# EAGLE schematic reva (EAGLE 9.6.2)
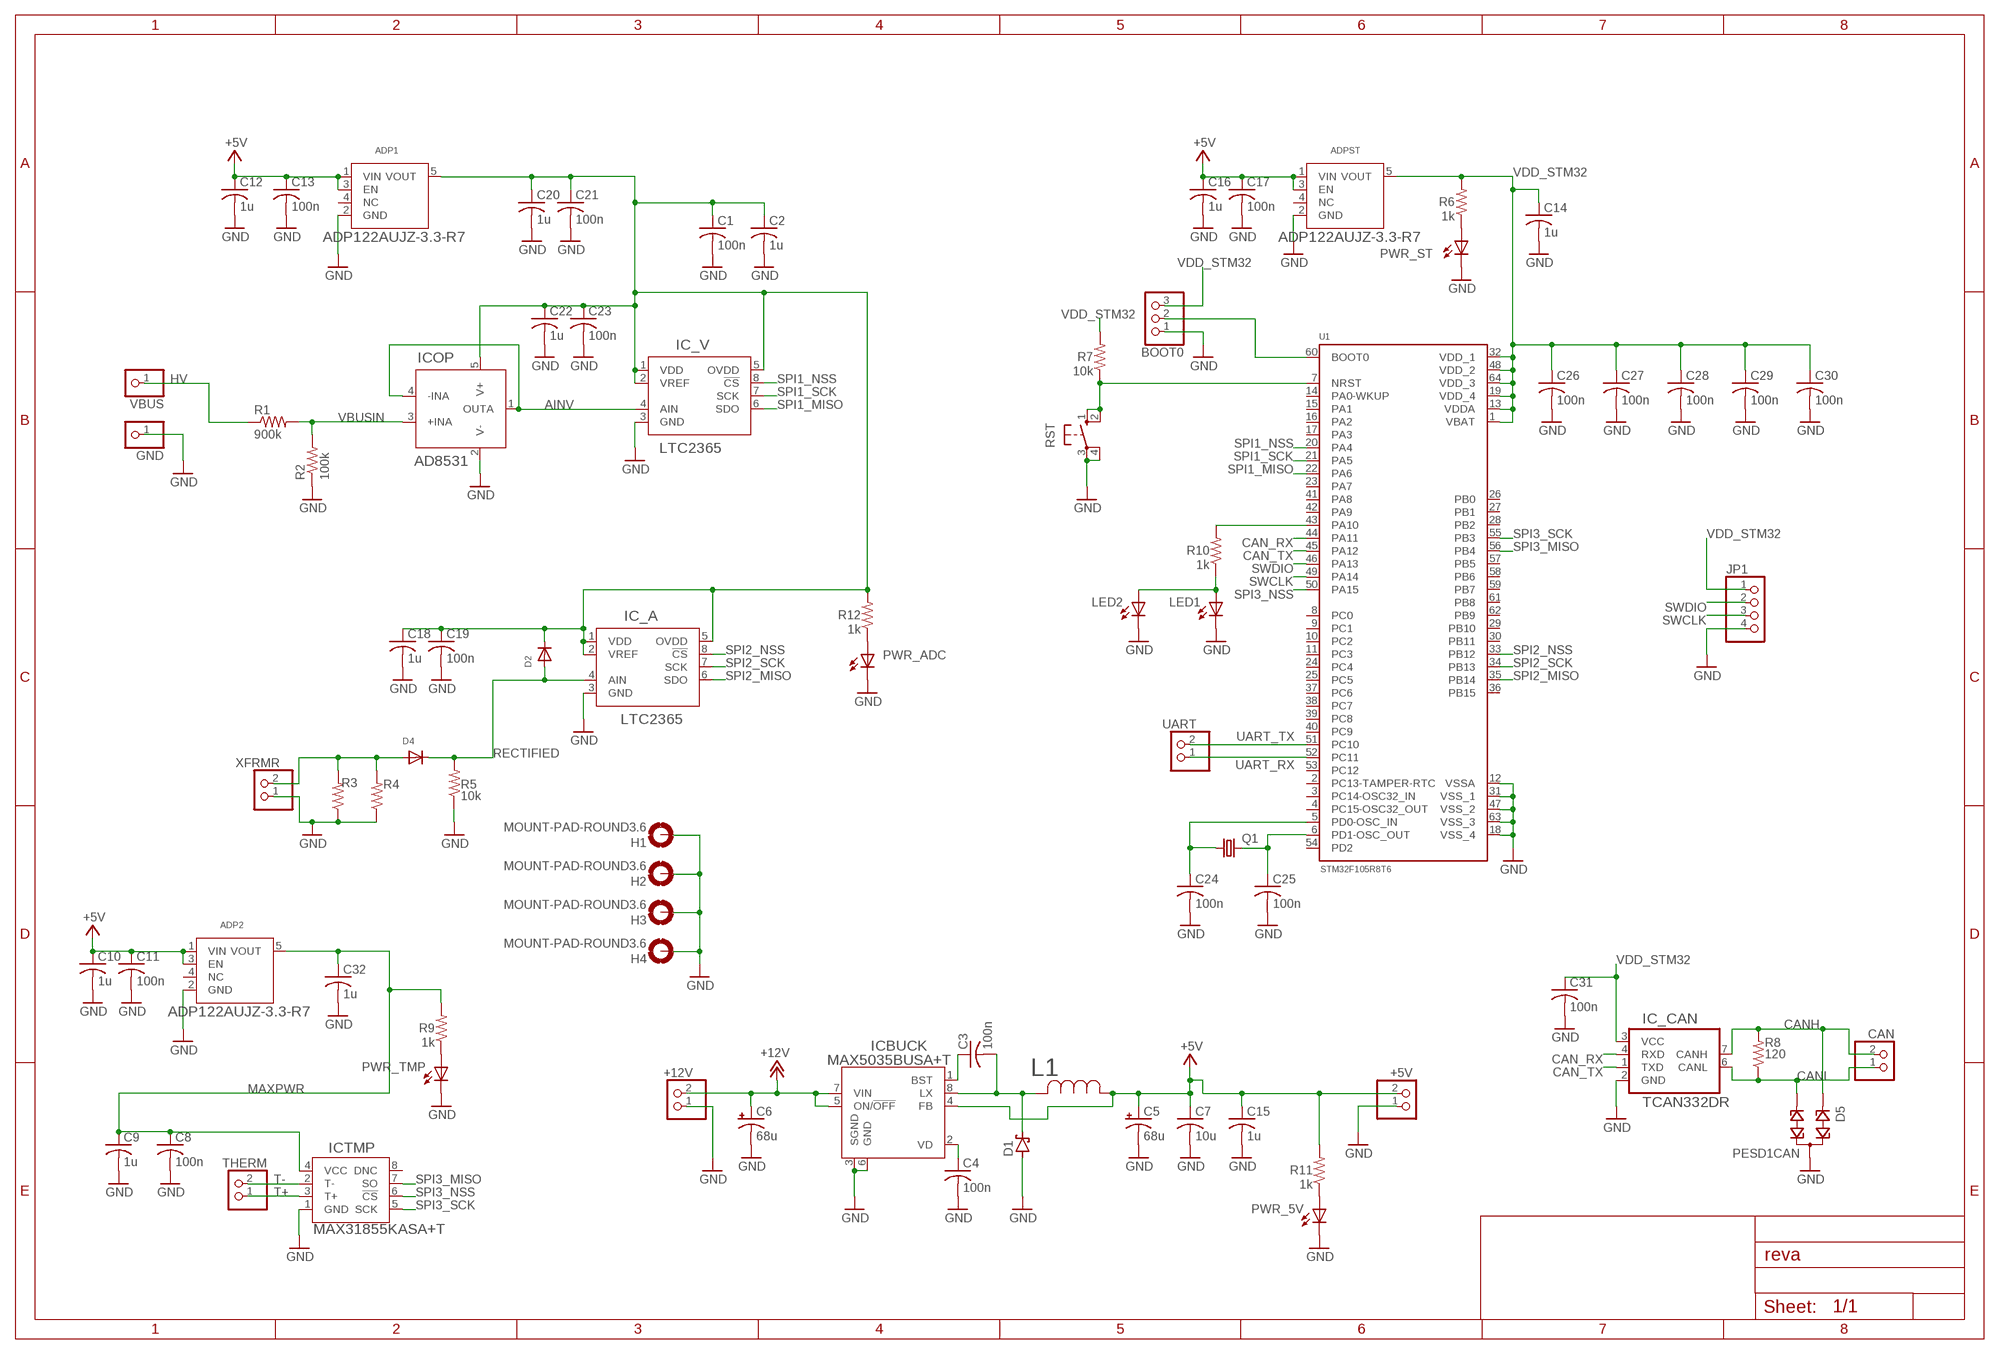
[diagram p0: schematic, sheet 1]

## Parts
+5V  PINHD-1X2  [1X02]
+12V  PINHD-1X2  [1X02]
ADP1  ADP122AUJZ-3.3-R7  [SOT95P280X100-5N]
ADP2  ADP122AUJZ-3.3-R7  [SOT95P280X100-5N]
ADPST  ADP122AUJZ-3.3-R7  [SOT95P280X100-5N]
BOOT0  PINHD-1X3  [1X03]
C1  100n  C-USC0603  [C0603]
C2  1u  C-USC0603  [C0603]
C3  100n  C-USC0603  [C0603]
C4  100n  C-USC0603  [C0603]
C5  68u  CPOL-USE5-8.5  [E5-8,5]
C6  68u  CPOL-USE5-8.5  [E5-8,5]
C7  10u  C-USC0805  [C0805]
C8  100n  C-USC0603  [C0603]
C9  1u  C-USC0603  [C0603]
C10  1u  C-USC0603  [C0603]
C11  100n  C-USC0603  [C0603]
C12  1u  C-USC0603  [C0603]
C13  100n  C-USC0603  [C0603]
C14  1u  C-USC0603  [C0603]
C15  1u  C-USC0603  [C0603]
C16  1u  C-USC0603  [C0603]
C17  100n  C-USC0603  [C0603]
C18  1u  C-USC0603  [C0603]
C19  100n  C-USC0603  [C0603]
C20  1u  C-USC0603  [C0603]
C21  100n  C-USC0603  [C0603]
C22  1u  C-USC0603  [C0603]
C23  100n  C-USC0603  [C0603]
C24  100n  C-USC0603  [C0603]
C25  100n  C-USC0603  [C0603]
C26  100n  C-USC0603  [C0603]
C27  100n  C-USC0603  [C0603]
C28  100n  C-USC0603  [C0603]
C29  100n  C-USC0603  [C0603]
C30  100n  C-USC0603  [C0603]
C31  100n  C-USC0603  [C0603]
C32  1u  C-USC0603  [C0603]
CAN  PINHD-1X2  [1X02]
D1  SCHOTTKY-DIODESMD  [SMB]
D2  DIODESOD-523  [SOD-523]
D4  DIODESOD-523  [SOD-523]
D5  PESD1CAN  [SOT23]
GND  PINHD-1X1CB  [1X01-CLEANBIG]
H1  MOUNT-PAD-ROUND3.6  [3,6-PAD]
H2  MOUNT-PAD-ROUND3.6  [3,6-PAD]
H3  MOUNT-PAD-ROUND3.6  [3,6-PAD]
H4  MOUNT-PAD-ROUND3.6  [3,6-PAD]
IC_A  LTC2365  LTC2365ITS8TRMPBF  [TSOT-23_TS8_LIT]
IC_CAN  TCAN332DR  [SOIC127P599X175-8N]
IC_V  LTC2365  LTC2365ITS8TRMPBF  [TSOT-23_TS8_LIT]
ICBUCK  MAX5035BUSA+T  [21-0041B_8_MXM]
ICOP  AD8531  AD8531ARTZ-REEL7  [RJ_5_ADI]
ICTMP  MAX31855KASA+T  [21-0041B_8_MXM]
JP1  PINHD-1X4  [1X04]
L1  IHLP4040DZER101M11  [IND_IHLP-4040DZ_VIS]
LED1  LED5MM  [LED5MM]
LED2  LEDCHIP-LED0805  [CHIP-LED0805]
PWR_5V  LEDCHIP-LED0805  [CHIP-LED0805]
PWR_ADC  LEDCHIP-LED0805  [CHIP-LED0805]
PWR_ST  LEDCHIP-LED0805  [CHIP-LED0805]
PWR_TMP  LEDCHIP-LED0805  [CHIP-LED0805]
Q1  CRYSTALHC49S  [HC49/S]
R1  900k  R-US_R0805  [R0805]
R2  100k  R-US_R0805  [R0805]
R3  R-US_R0805  [R0805]
R4  R-US_0204/7  [0204/7]
R5  10k  R-US_R0805  [R0805]
R6  1k  R-US_R0805  [R0805]
R7  10k  R-US_R0805  [R0805]
R8  120  R-US_R0805  [R0805]
R9  1k  R-US_R0805  [R0805]
R10  1k  R-US_R0805  [R0805]
R11  1k  R-US_R0805  [R0805]
R12  1k  R-US_R0805  [R0805]
RST  10-XX  [B3F-10XX]
THERM  PINHD-1X2  [1X02]
U1  STM32F105R8T6  [QFP50P1200X1200X160-64N]
UART  PINHD-1X2  [1X02]
VBUS  PINHD-1X1CB  [1X01-CLEANBIG]
XFRMR  PINHD-1X2  [1X02]

## Nets
+5V: +5V.2 ADP1.1(VIN) ADP1.3(EN) ADP2.1(VIN) ADP2.3(EN) ADPST.1(VIN) ADPST.3(EN) C5.+ C7.1 C10.1 C11.1 C12.1 C13.1 C15.1 C16.1 C17.1 ICBUCK.4(FB) L1.1 R11.2
+12V: +12V.2 C6.+ ICBUCK.5(ON/!OFF) ICBUCK.7(VIN)
AINV: IC_V.4(AIN) ICOP.1(OUTA) ICOP.4(-INA)
CAN_RX: IC_CAN.4(RXD) U1.44(PA11)
CAN_TX: IC_CAN.1(TXD) U1.45(PA12)
CANH: CAN.2 D5.1 IC_CAN.7(CANH) R8.2
CANL: CAN.1 D5.2 IC_CAN.6(CANL) R8.1
CUR+: D4.A R3.2 R4.2 XFRMR.2
GND: +5V.1 +12V.1 ADP1.2(GND) ADP2.2(GND) ADPST.2(GND) BOOT0.1 C1.2 C2.2 C4.2 C5.- C6.- C7.2 C8.2 C9.2 C10.2 C11.2 C12.2 C13.2 C14.2 C15.2 C16.2 C17.2 C18.2 C19.2 C20.2 C21.2 C22.2 C23.2 C24.2 C25.2 C26.2 C27.2 C28.2 C29.2 C30.2 C31.2 C32.2 D1.A D5.3 GND.1 H1.B3,6(MOUNT) H2.B3,6(MOUNT) H3.B3,6(MOUNT) H4.B3,6(MOUNT) IC_A.3(GND) IC_CAN.2(GND) IC_V.3(GND) ICBUCK.3(SGND) ICBUCK.6(GND) ICOP.2(V-) ICTMP.1(GND) JP1.4 LED1.K(C) LED2.C PWR_5V.C PWR_ADC.C PWR_ST.C PWR_TMP.C R2.1 R3.1 R4.1 R5.1 RST.3(P) RST.4(P1) U1.12(VSSA) U1.18(VSS_4) U1.31(VSS_1) U1.47(VSS_2) U1.63(VSS_3) XFRMR.1
HV: R1.1 VBUS.1
MAXPWR: ADP2.5(VOUT) C8.1 C9.1 C32.1 ICTMP.4(VCC) R9.2
N$1: C3.2 D1.C ICBUCK.8(LX) L1.2
N$2: C3.1 ICBUCK.1(BST)
N$3: PWR_ST.A R6.1
N$4: C4.1 ICBUCK.2(VD)
N$5: PWR_TMP.A R9.1
N$6: PWR_5V.A R11.1
N$7: PWR_ADC.A R12.1
N$15: R7.1 RST.1(S) RST.2(S1) U1.7(NRST)
N$16: R10.2 U1.43(PA10)
N$17: LED1.A LED2.A R10.1
N$18: BOOT0.2 U1.60(BOOT0)
N$24: C24.1 Q1.1 U1.5(PD0-OSC_IN)
N$25: C25.1 Q1.2 U1.6(PD1-OSC_OUT)
RECTIFIED: D2.A D4.K(C) IC_A.4(AIN) R5.2
SPI1_MISO: IC_V.6(SDO) U1.22(PA6)
SPI1_NSS: IC_V.8(!CS) U1.20(PA4)
SPI1_SCK: IC_V.7(SCK) U1.21(PA5)
SPI2_MISO: IC_A.6(SDO) U1.35(PB14)
SPI2_NSS: IC_A.8(!CS) U1.33(PB12)
SPI2_SCK: IC_A.7(SCK) U1.34(PB13)
SPI3_MISO: ICTMP.7(SO) U1.56(PB4)
SPI3_NSS: ICTMP.6(!CS) U1.50(PA15)
SPI3_SCK: ICTMP.5(SCK) U1.55(PB3)
SWCLK: JP1.3 U1.49(PA14)
SWDIO: JP1.2 U1.46(PA13)
T+: ICTMP.3(T+) THERM.1
T-: ICTMP.2(T-) THERM.2
UART_RX: U1.52(PC11) UART.1
UART_TX: U1.51(PC10) UART.2
VBUSIN: ICOP.3(+INA) R1.2 R2.2
VDD_OP: ADP1.5(VOUT) C1.1 C2.1 C18.1 C19.1 C20.1 C21.1 C22.1 C23.1 D2.K(C) IC_A.1(VDD) IC_A.2(VREF) IC_A.5(OVDD) IC_V.1(VDD) IC_V.2(VREF) IC_V.5(OVDD) ICOP.5(V+) R12.2
VDD_STM32: ADPST.5(VOUT) BOOT0.3 C14.1 C26.1 C27.1 C28.1 C29.1 C30.1 C31.1 IC_CAN.3(VCC) JP1.1 R6.2 R7.2 U1.1(VBAT) U1.13(VDDA) U1.19(VDD_4) U1.32(VDD_1) U1.48(VDD_2) U1.64(VDD_3)
Unconnected: ADP1.4(NC) ADP2.4(NC) ADPST.4(NC) ICTMP.8(DNC) U1.2(PC13-TAMPER-RTC) U1.3(PC14-OSC32_IN) U1.4(PC15-OSC32_OUT) U1.8(PC0) U1.9(PC1) U1.10(PC2) U1.11(PC3) U1.14(PA0-WKUP) U1.15(PA1) U1.16(PA2) U1.17(PA3) U1.23(PA7) U1.24(PC4) U1.25(PC5) U1.26(PB0) U1.27(PB1) U1.28(PB2) U1.29(PB10) U1.30(PB11) U1.36(PB15) U1.37(PC6) U1.38(PC7) U1.39(PC8) U1.40(PC9) U1.41(PA8) U1.42(PA9) U1.53(PC12) U1.54(PD2) U1.57(PB5) U1.58(PB6) U1.59(PB7) U1.61(PB8) U1.62(PB9)

## Library data of the parts
+5V +12V CAN THERM UART XFRMR = pinhead:PINHD-1X2: PIN HEADER
ADP1 ADP2 ADPST = Analog Devices_By_element14_Batch_1:ADP122AUJZ-3.3-R7: CMOS Linear Regulators; MPN: ADP122AUJZ-3.3-R7; OC_FARNELL: 1858064; OC_NEWARK: 60R3274; PACKAGE: SOT-23-5; SUPPLIER: ANALOG DEVICES
BOOT0 = adafruit:PINHD-1X3: PIN HEADER
C1-C4 C7-C32 = rcl:C-US: CAPACITOR, American symbol; SPICEPREFIX: C
C5 C6 = adafruit:CPOL-US: POLARIZED CAPACITOR, American symbol
D1 = diode:SCHOTTKY-DIODE: Schottky Diode
D2 D4 = adafruit:DIODE: Diode SMADIODE - SMA Surface Mount Package 20V 1A Schottky Diode Digikey: 641-1014-6-ND DO-1N4148 - Through Hole Small Current Diode SOD-123 20V 1 A (.5mV Vf) Schottky Diode - Digikey: MBRX120TPMSCT-ND SOD-323 10V 570mA (.38mV Vf, 3ns) Schottky Diode - Digikey: ZLLS410CT-ND SOD-523 30V 30mA Schottky Diode (RB751S-40TE61) - Digikey: RB751S-40TE61CT-ND SOT23-R/W - SOT23 Package (R = Solder Paste/Reflow Ovens, W = Hand-Soldering) BAT54Film 40V 300mA - Digikey: 497-7162-1-ND
D5 = diode:PESD1CAN: CAN bus ESD protection diode Source: http://www.nxp.com/documents/data_sheet/PESD1CAN.pdf
GND VBUS = adafruit:PINHD-1X1: Pin header 1x1 for 0.1" spacing With round pins
H1-H4 = holes:MOUNT-PAD-ROUND: MOUNTING PAD, round
IC_A IC_V = temp_sens_proj:LTC2365ITS8TRMPBF; COPYRIGHT: Copyright (C) 2023 Ultra Librarian. All rights reserved.; MANUFACTURER_PART_NUMBER: LTC2365ITS8#TRMPBF; MFR_NAME: Analog Devices Inc
IC_CAN = TCAN332DR:TCAN332DR: Check availability <https://pricing.snapeda.com/parts/TCAN332DR/Texas%20Instruments/view-part?ref=eda>; AVAILABILITY: In Stock; CHECK_PRICES: https://www.snapeda.com/parts/TCAN332DR/Texas+Instruments/view-part/?ref=eda; DESCRIPTION: 3.3-V CAN Transceivers; MF: Texas Instruments; MP: TCAN332DR; PACKAGE: SOIC-8 Texas Instruments; PRICE: None; PURCHASE-URL: https://www.snapeda.com/api/url_track_click_mouser/?unipart_id=381755&manufacturer=Texas Instruments&part_name=TCAN332DR&search_term=can; SNAPEDA_LINK: https://www.snapeda.com/parts/TCAN332DR/Texas+Instruments/view-part/?ref=snap
ICBUCK = max5035:MAX5035BUSA+T; COPYRIGHT: Copyright (C) 2023 Ultra Librarian. All rights reserved.; DIGIKEY_PART_NUMBER_1: MAX5035BUSA+T-ND; DIGIKEY_PART_NUMBER_2: MAX5035BUSA+TCT-ND; DIGIKEY_PART_NUMBER_3: MAX5035BUSA+TDKR-ND; DIGIKEY_PART_NUMBER_4: MAX5035BUSA+TTR-ND; MANUFACTURER_PART_NUMBER: max5035busa+T; MFR_NAME: Analog Devices Inc
ICOP = temp_sens_proj:AD8531ARTZ-REEL7; COPYRIGHT: Copyright (C) 2023 Ultra Librarian. All rights reserved.; DIGIKEY_PART_NUMBER_1: AD8531ARTZ-REEL7CT-ND; DIGIKEY_PART_NUMBER_2: AD8531ARTZ-REEL7DKR-ND; DIGIKEY_PART_NUMBER_3: AD8531ARTZ-REEL7TR-ND; DIGIKEY_PART_NUMBER_4: 2156-AD8531ARTZ-REEL7-ND; MANUFACTURER_PART_NUMBER: AD8531ARTZ-REEL7; MFR_NAME: Analog Devices Inc
ICTMP = temp_sens_proj:MAX31855KASA+T; COPYRIGHT: Copyright (C) 2023 Ultra Librarian. All rights reserved.; MANUFACTURER_PART_NUMBER: MAX31855KASA+T; MFR_NAME: Analog Devices / Maxim Integrated
JP1 = pinhead:PINHD-1X4: PIN HEADER
L1 = temp_sens_proj:IHLP4040DZER101M11; COPYRIGHT: Copyright (C) 2023 Ultra Librarian. All rights reserved.; DIGIKEY_PART_NUMBER_1: 541-1310-1-ND; DIGIKEY_PART_NUMBER_2: 541-1310-2-ND; DIGIKEY_PART_NUMBER_3: 541-1310-2-NDL; DIGIKEY_PART_NUMBER_4: 541-1310-6-ND; MANUFACTURER_PART_NUMBER: IHLP4040DZER101M11; MFR_NAME: Vishay
LED1 LED2 PWR_5V PWR_ADC PWR_ST PWR_TMP = adafruit:LED: LED OSRAM: - CHIPLED LG R971, LG N971, LY N971, LG Q971, LY Q971, LO R971, LY R971 LH N974, LH R974 LS Q976, LO Q976, LY Q976 LO Q996 - Hyper CHIPLED LW Q18S LB Q993, LB Q99A, LB R99A - SideLED LS A670, LO A670, LY A670, LG A670, LP A670 LB A673, LV A673, LT A673, LW A673 LH A674 LY A675 LS A676, LA A676, LO A676, LY A676, LW A676 LS A679, LY A679, LG A679 - Hyper Micro SIDELED® LS Y876, LA Y876, LO Y876, LY Y876 LT Y87S - SmartLED LW L88C, LW L88S LB L89C, LB L89S, LG L890 LS L89K, LO L89K, LY L89K LS L896, LA L896, LO L896, LY L896 - TOPLED LS T670, LO T670, LY T670, LG T670, LP T670 LSG T670, LSP T670, LSY T670, LOP T670, LYG T670 LG T671, LOG T671, LSG T671 LB T673, LV T673, LT T673, LW T673 LH T674 LS T676, LA T676, LO T676, LY T676, LB T676, LH T676, LSB T676, LW T676 LB T67C, LV T67C, LT T67C, LS T67K, LO T67K, LY T67K, LW E67C LS E67B, LA E67B, LO E67B, LY E67B, LB E67C, LV E67C, LT E67C LW T67C LS T679, LY T679, LG T679 LS T770, LO T770, LY T770, LG T770, LP T770 LB T773, LV T773, LT T773, LW T773 LH T774 LS E675, LA E675, LY E675, LS T675 LS T776, LA T776, LO T776, LY T776, LB T776 LHGB T686 LT T68C, LB T68C - Hyper Mini TOPLED® LB M676 - Mini TOPLED Santana® LG M470 LS M47K, LO M47K, LY M47K Source: http://www.osram.convergy.de/
Q1 = adafruit:CRYSTAL: CRYSTAL; OC_FARNELL: 1667008; OC_NEWARK: unknown
R1-R12 = adafruit:R-US_: RESISTOR, American symbol
RST = switch-omron:10-XX: OMRON SWITCH; MPN: B3F-1000; OC_FARNELL: 176432; OC_NEWARK: 36M3542
U1 = STM32F105R8T6:STM32F105R8T6: Mainstream Connectivity line, ARM Cortex-M3 with 64 Kbytes Flash, 72 MHz CPU, CAN, USB 2.0 OTG; CHECK_PRICES: https://www.snapeda.com/parts/STM32F105R8T6/STMicroelectronics/view-part/?ref=eda; DESCRIPTION: ARM® Cortex®-M3 STM32F1 Microcontroller IC 32-Bit 72MHz 64KB (64K x 8) FLASH 64-LQFP (10x10); DIGIKEY_PART_NUMBER: 497-8922-ND; MF: STMicroelectronics; MP: STM32F105R8T6; PACKAGE: LQFP-64 STMicroelectronics; PURCHASE-URL: https://www.snapeda.com/api/url_track_click_mouser/?unipart_id=423032&manufacturer=STMicroelectronics&part_name=STM32F105R8T6&search_term=None; SNAPEDA_LINK: https://www.snapeda.com/parts/STM32F105R8T6/STMicroelectronics/view-part/?ref=snap